# Altium schematic sheet Power.SchDoc
size A4; SheetNumber: 1; SheetTotal: 2
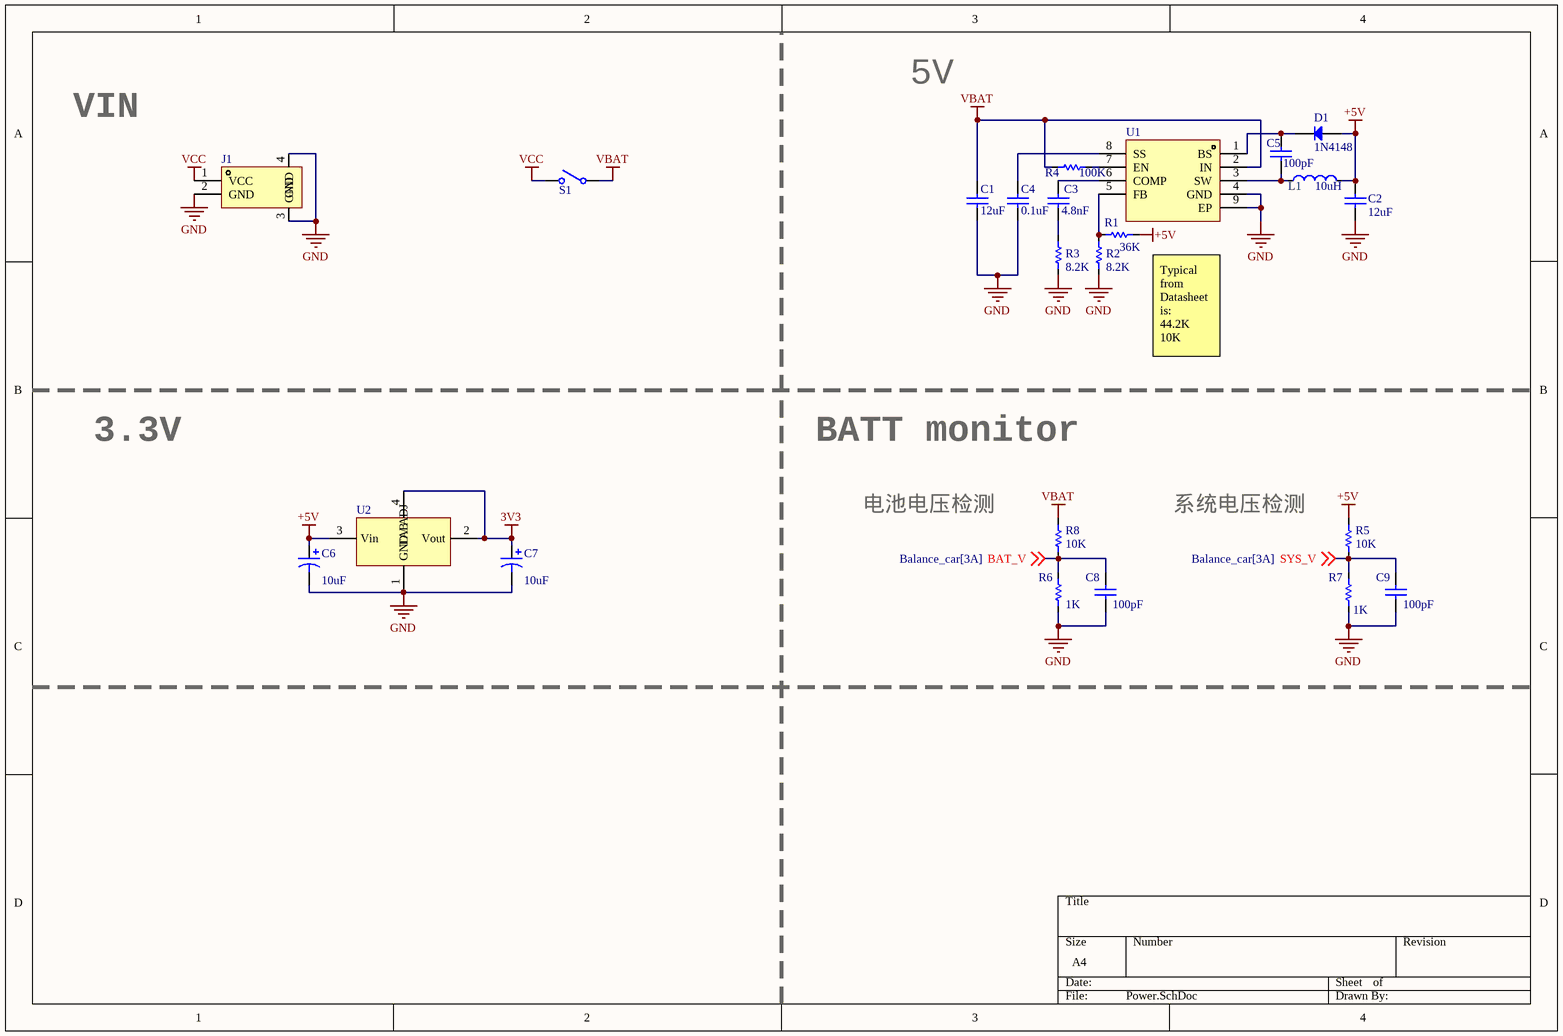
[diagram p0: Power.SchDoc]

## Parts
C1  value 12uF  [C1206]  (hidden comment: Cap)
C2  value 12uF  [C1206]  (hidden comment: Cap)
C3  value 4.8nF  [C0603]  (hidden comment: Cap)
C4  value 0.1uF  [C0603]  (hidden comment: Cap)
C5  value 100pF  [C0603]  (hidden comment: Cap)
C6  value 10uF  [CAP-SMD_BD4.0-L4.3-W4.3-FD-LS5.3]  (hidden comment: Cap Pol)
C7  value 10uF  [CAP-SMD_BD4.0-L4.3-W4.3-FD-LS5.3]  (hidden comment: Cap Pol)
C8  value 100pF  [C0603]  (hidden comment: Cap)
C9  value 100pF  [C0603]  (hidden comment: Cap)
D1  1N4148  [SOD-123F]
J1  XT60PW-M  [XT60PW-M]  (value not drawn)
L1  10uH  [IND-SMD_L7.3-W6.6]
R1  value 36K  [R0402]  (hidden comment: Res)
R2  value 8.2K  [R0402]  (hidden comment: Res)
R3  value 8.2K  [R0603]  (hidden comment: Res)
R4  value 100K  [R0603]  (hidden comment: Res)
R5  value 10K  [R0402]  (hidden comment: Res)
R6  value 1K  [R0402]  (hidden comment: Res)
R7  value 1K  [R0402]  (hidden comment: Res)
R8  value 10K  [R0402]  (hidden comment: Res)
S1  SW-PB  [SW-PB]  (value not drawn)
U1  MP2307  [MP2307]  (value not drawn)
U2  1117  [SOT-223-3]  (value not drawn)

## Nets
3V3: C7.1 U2.2(Vout) U2.4(TAB)
+5V: C2.1 C6.1 D1.2(A) L1.2 R1.1 R5.1 U2.3(Vin)
GND: C1.1 C2.2 C4.1 C6.2 C7.2 C8.2 C9.2 J1.2(GND) J1.3(GND) J1.4(GND) R2.1 R3.1 R6.2 R7.2 U1.4(GND) U1.9(EP) U2.1(GND_/_ADJ)
VBAT: C1.2 R4.1 R8.1 S1.1(COMMON) U1.2(IN)
VCC: J1.1(VCC) S1.2(NO)
BAT_V: C8.1 R6.1 R8.2 ; off-sheet BAT_V
SYS_V: C9.1 R5.2 R7.1 ; off-sheet SYS_V
NetC3_1: C3.1 R3.2
NetC3_2: C3.2 U1.6(COMP)
NetC4_2: C4.2 U1.8(SS)
NetC5_1: C5.1 L1.1 U1.3(SW)
NetC5_2: C5.2 D1.1(K) U1.1(BS)
NetR1_2: R1.2 R2.2 U1.5(FB)
NetR4_2: R4.2 U1.7(EN)

## Notes on the sheet
- 5V
- VIN
- (near R1) Typical from Datasheet is:
  44.2K    10K
- 3.3V
- BATT monitor
- 电池电压检测
- 系统电压检测

## Library data of the parts
C1-C5 C8 C9 = Cap: Capacitor; Published: 8-Jun-2000; LatestRevisionDate: 17-Jul-2002; LatestRevisionNote: Re-released for DXP Platform.; PackageReference: RAD-0.3; Publisher: Altium Limited; PackageDescription: Radial Cap, Thru-Hole; 2 Leads; 0.3 in Pin Spacing
C6 C7 = Cap Pol: Polarized Capacitor (Axial); Published: 8-Jun-2000; LatestRevisionDate: 17-Jul-2002; LatestRevisionNote: Re-released for DXP Platform.; PackageReference: POLAR0.8; Publisher: Altium Limited; PackageDescription: Polarized Capacitor; 2 Leads
D1 = 1N4148: High Conductance Fast Diode; Published: 8-Jun-2000; LatestRevisionDate: 17-Jul-2002; LatestRevisionNote: Re-released for DXP Platform.; DatasheetVersion: 1997; PackageReference: DO-35; Publisher: Altium Limited; PackageDescription: Diode, Axial; Body 3.8 x 1.9 mm (LxDia. max), Lead Dia. 0.53 mm (max); Code_JEDEC: DO-204-AH; ComponentLink1Description: Manufacturer Link; ComponentLink1URL: http://www.fairchildsemi.com/; ComponentLink2Description: Datasheet; ComponentLink2URL: http://www.fairchildsemi.com/ds/1N%2F1N4148.pdf
L1 = IND-SMD_L7.3-W6.6: 电感值:10uH;精度:±20%;额定电流:4A;饱和电流(Isat):5.5A;直流电阻(DCR):62mΩ;; Manufacturer: PSA(信昌电陶); Symbol: MCS0630-100MPY1; Add into BOM: yes; Tolerance: ±20%; Rated Current: 4A; Saturation Current (Isat): 5.5A; DC Resistance (DCR): 62mΩ; Name: 10uH; Device: MCS0630-100MPY1; LCSC Part Name: 10uH ±20% 4A 62mΩ; Supplier Part: C2937094; Manufacturer Part: MCS0630-100MPY1; Supplier Footprint: 0630; JLCPCB Part Class: Extended Part; Datasheet: https://atta.szlcsc.com/upload/public/pdf/source/20220121/EA6E6E6F70ED7BAE67EC293805EAAACB.pdf; Supplier: LCSC; Convert to PCB: yes; Value: 10uH
R1-R8 = Res: Resistor; Published: 8-Jun-2000; LatestRevisionDate: 17-Jul-2002; LatestRevisionNote: Re-released for DXP Platform.; PackageReference: AXIAL-0.3; Publisher: Altium Limited; PackageDescription: Axial Device, Thru-Hole; 2 Leads; 0.3 in Pin Spacing
S1 = SW-PB: 船型开关; Published: 24-Mar-1999; LatestRevisionDate: 17-Jul-2002; LatestRevisionNote: Re-released for DXP Platform.; PackageReference: SPST-2; Publisher: Altium Limited; PackageDescription: Switch; 2 Leads